# EAGLE design LCDBreakout (EAGLE 7.2.0)
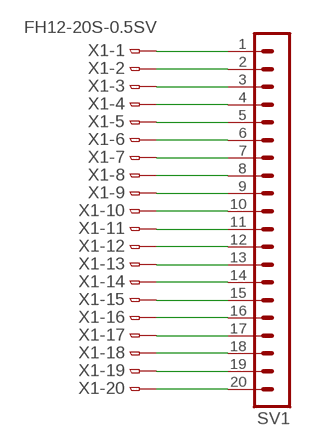
[diagram p0: schematic, sheet 1]

## Parts
SV1  MA20-1W  [MA20-1W]
X1  FH12-20S-0.5SV  [FH12-20S-0.5SV]

## Nets
N$1: SV1.1 X1.1
N$2: SV1.2 X1.2
N$3: SV1.3 X1.3
N$4: SV1.4 X1.4
N$5: SV1.5 X1.5
N$6: SV1.6 X1.6
N$7: SV1.7 X1.7
N$8: SV1.8 X1.8
N$9: SV1.9 X1.9
N$10: SV1.10 X1.10
N$11: SV1.11 X1.11
N$12: SV1.12 X1.12
N$13: SV1.13 X1.13
N$14: SV1.14 X1.14
N$15: SV1.15 X1.15
N$16: SV1.16 X1.16
N$17: SV1.17 X1.17
N$18: SV1.18 X1.18
N$19: SV1.19 X1.19
N$20: SV1.20 X1.20

## Library data of the parts
SV1 = con-lstb:MA20-1W: PIN HEADER; OC_FARNELL: unknown; OC_NEWARK: unknown
X1 = own-collection:FH12-20S-0.5S: 0.5mm Pitch Connectors For FPC/FFC Source: Data sheet <http://www.hirose.co.jp/cataloge_hp/e58605370.pdf>

## Board
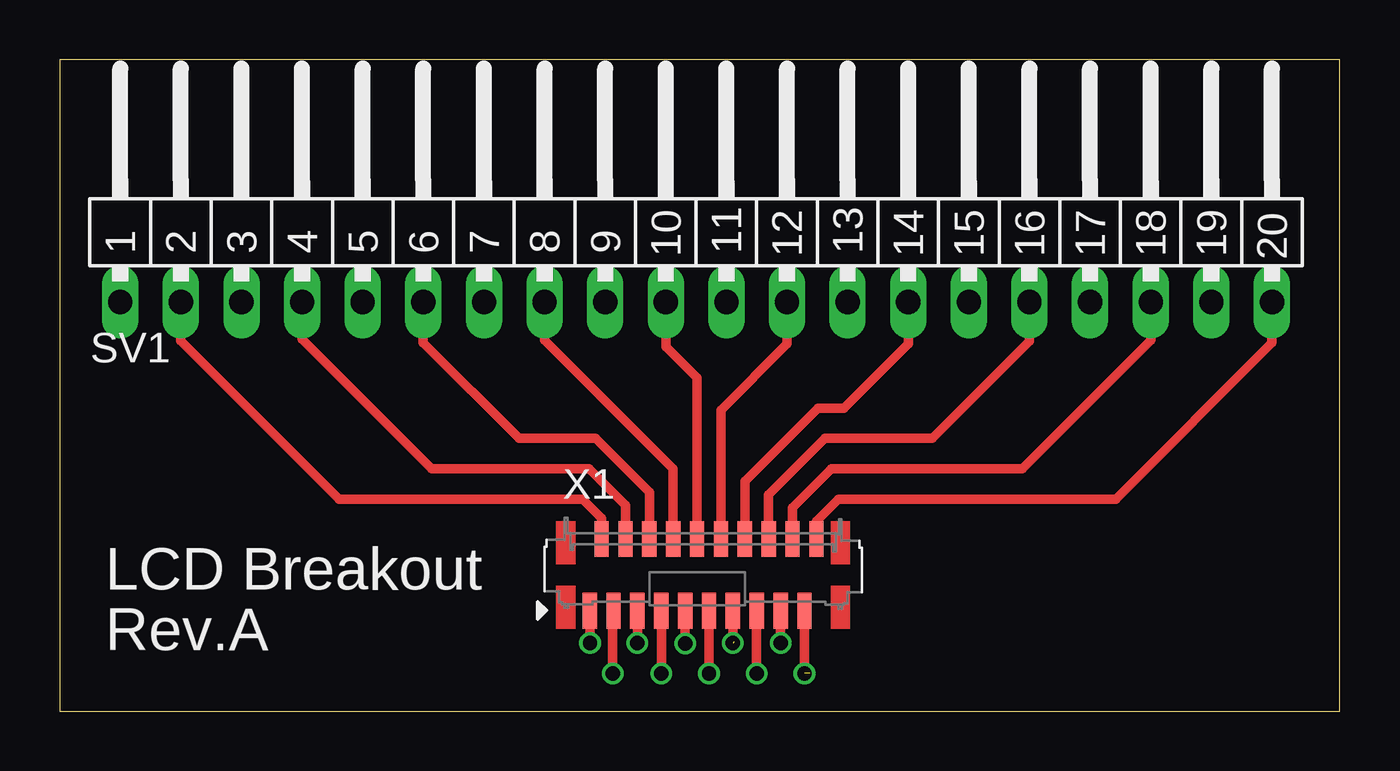
[diagram p1: board, top side]
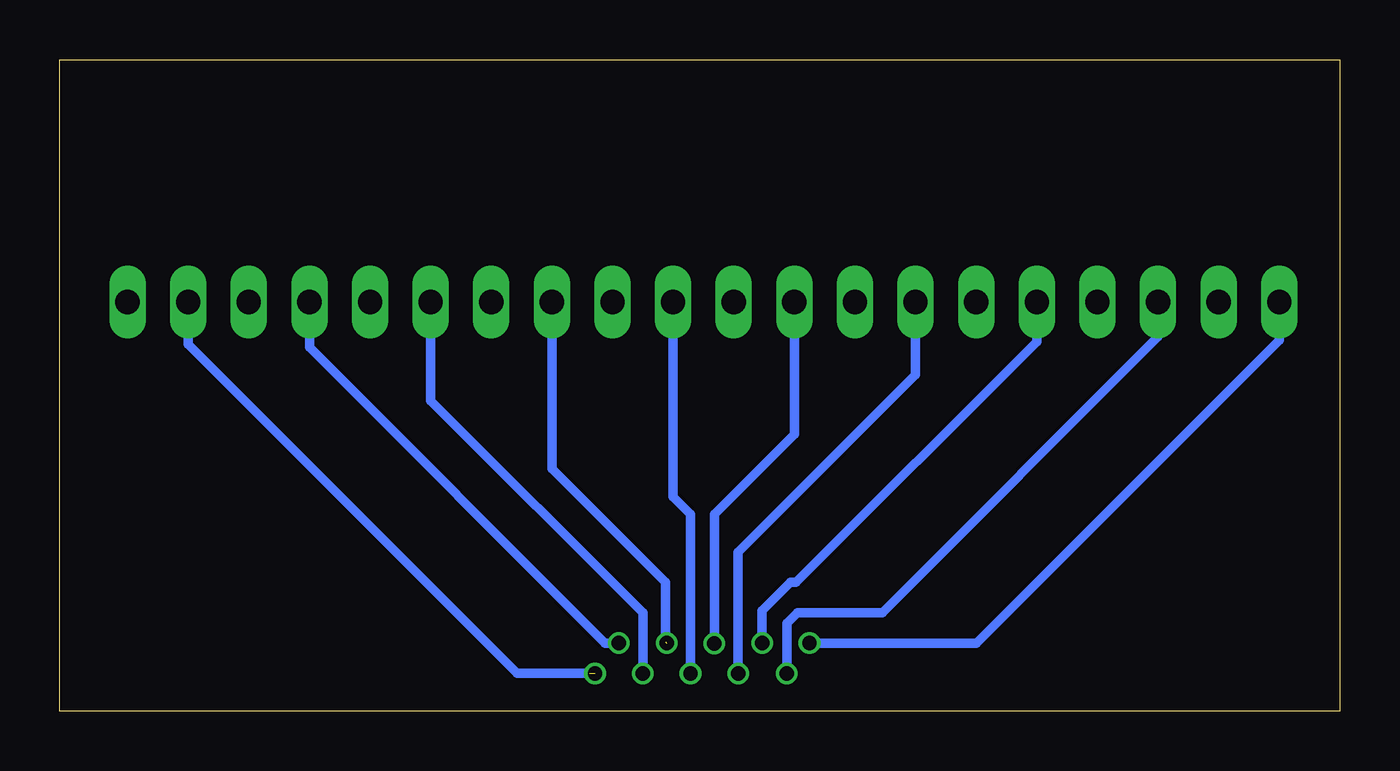
[diagram p2: board, bottom side, seen from below]

Size 53.65 x 27.3 mm. Coordinates in mm from the lower left corner, seen from the top.
Outline: 0,0 53.65,0 53.65,27.3 0,27.3 0,0
Copper layers (1*16): Top 0.035mm / dielectric 1.5mm / Bottom 0.035mm
Design rules "dirt_cheap_dirty_boards.v1": minimum track width 5mil, minimum drill 12mil, track to track 5mil, track to pad 5mil, pad to pad 5mil, via to via 5mil, smd to smd 0mil, copper to edge 10mil, drill to drill 10mil, minimum pad ring 10mil, minimum via ring 6mil, stop-mask expansion 2mil, vias tented up to drill 25mil, thermal gap 10mil

### Footprints (pad centres in the part's own frame; a part is rotated, then mirrored left to right if it is on the bottom)
MA20-1W = drill 1.016 long: 1 -24.13,0; 2 -21.59,0; 3 -19.05,0; 4 -16.51,0; 5 -13.97,0; 6 -11.43,0; 7 -8.89,0; 8 -6.35,0; 9 -3.81,0; 10 -1.27,0; 11 1.27,0; 12 3.81,0; 13 6.35,0; 14 8.89,0; 15 11.43,0; 16 13.97,0; 17 16.51,0; 18 19.05,0; 19 21.59,0; 20 24.13,0
FH12-20S-0.5SV = smd 0.6 x 1.5: 1 -4.46,-1.5; 2 -3.96,1.5; 3 -3.46,-1.5; 4 -2.96,1.5; 5 -2.46,-1.5; 6 -1.96,1.5; 7 -1.46,-1.5; 8 -0.96,1.5; 9 -0.46,-1.5; 10 0.04,1.5; 11 0.54,-1.5; 12 1.04,1.5; 13 1.54,-1.5; 14 2.04,1.5; 15 2.54,-1.5; 16 3.04,1.5; 17 3.54,-1.5; 18 4.04,1.5; 19 4.54,-1.5; 20 5.04,1.5

### Placement (x,y rotation side)
SV1  26.67,17.14 0 top
X1  26.67,5.71 0 top

### Tracks (layer width: path | path; a pad name or v marks a point on that pad's centre or on a via)
N$1  (via drill 0.6)
  Top 0.406: X1.1 22.23,4.2 v22.23,2.86
  Bottom 0.406: v22.23,2.86 15.23,2.86 2.54,15.55 SV1.1
N$2
  Top 0.406: X1.2 22.71,8.09 21.91,8.89 11.71,8.89 5.08,15.52 SV1.2
N$3  (via drill 0.6)
  Top 0.406: X1.3 23.18,4.18 v23.18,1.59
  Bottom 0.406: v23.18,1.59 23.18,3.68 22.73,4.13 19.18,4.13 7.62,15.69 SV1.3
N$4
  Top 0.406: X1.4 23.71,8.63 22.18,10.16 15.59,10.16 10.16,15.59 SV1.4
N$5  (via drill 0.6)
  Top 0.406: X1.5 v24.21,2.86
  Bottom 0.406: v24.21,2.86 X1.5 23.02,5.4 22.79,5.4 12.7,15.48 SV1.5
N$6
  Top 0.406: X1.6 24.71,9.17 22.45,11.43 19.26,11.43 15.24,15.45 SV1.6
N$7  (via drill 0.6)
  Top 0.406: X1.7 v25.21,1.59
  Bottom 0.406: v25.21,1.59 25.21,6.67 17.78,14.1 SV1.7
N$8
  Top 0.406: X1.8 25.71,10.15 20.32,15.54 SV1.8
N$9  (via drill 0.6)
  Top 0.406: X1.9 v26.21,2.84
  Bottom 0.406: v26.21,2.84 26.21,8.26 22.86,11.61 SV1.9
N$10
  Top 0.406: X1.10 26.71,13.97 25.4,15.28 SV1.10
N$11  (via drill 0.6)
  Top 0.406: v27.21,1.59 X1.11
  Bottom 0.406: v27.21,1.59 27.21,8.26 27.94,8.98 SV1.11
N$12
  Top 0.406: X1.12 27.71,12.62 30.48,15.39 SV1.12
N$13  (via drill 0.6)  (1 unrouted)
  Top 0.406: v28.21,2.86 X1.13
  Bottom 0.406: 28.26,2.9 28.26,5.4 33.02,10.16 SV1.13
N$14
  Top 0.406: X1.14 28.71,9.63 31.78,12.7 32.87,12.7 35.56,15.39 SV1.14
N$15  (via drill 0.6)
  Top 0.406: v29.21,1.59 X1.15
  Bottom 0.406: v29.21,1.59 29.21,4.13 38.1,13.02 SV1.15
N$16
  Top 0.406: X1.16 29.71,9.06 32.08,11.43 36.57,11.43 40.64,15.5 SV1.16
N$17  (via drill 0.6)
  Top 0.406: v30.21,2.86 X1.17
  Bottom 0.406: v30.21,2.86 30.8,2.86 43.18,15.24 SV1.17
N$18
  Top 0.406: X1.18 30.71,8.52 32.35,10.16 40.33,10.16 45.72,15.55 SV1.18
N$19  (via drill 0.6)  (1 unrouted)
  Top 0.406: X1.19 v31.21,1.59
  Bottom 0.406: 31.43,1.59 34.48,1.59 48.26,15.37 SV1.19
N$20
  Top 0.406: X1.20 31.71,7.96 32.64,8.89 44.26,8.89 50.8,15.43 SV1.20

### Text on the board
tNames: LCD Breakout | Rev.A